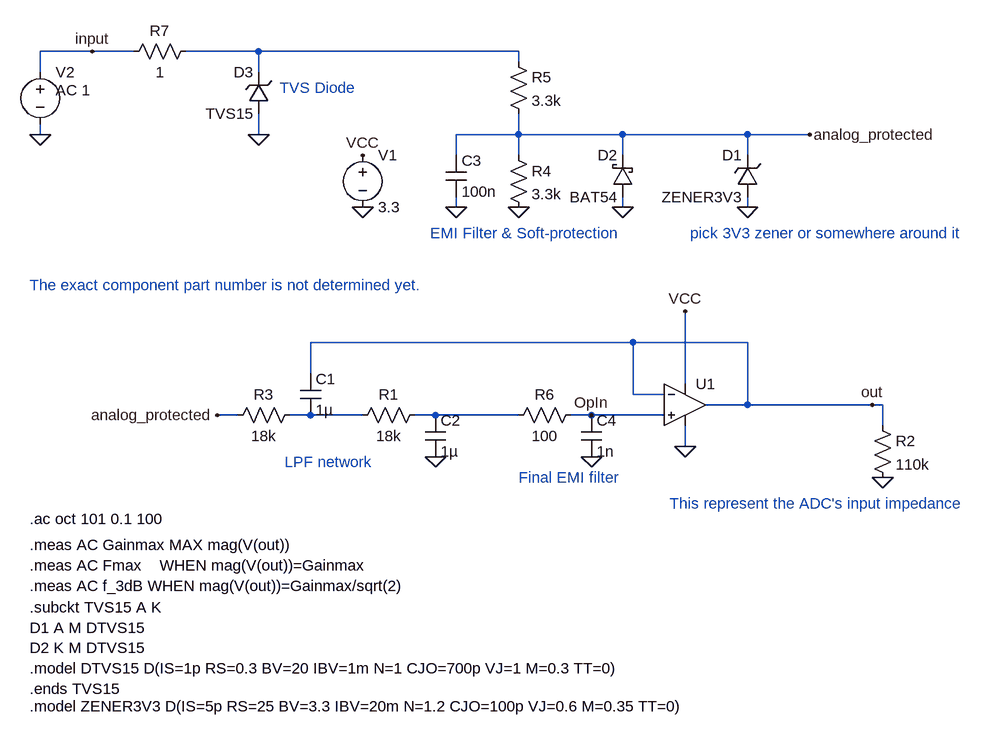
[diagram p0: schematic Anti-Alias Filter - BW.asc]
Anti-Alias Filter - BW.asc, the LTspice schematic file:
Version 4.1
SHEET 1 1140 912
WIRE -608 -240 -688 -240
WIRE -544 -240 -608 -240
WIRE -352 -240 -464 -240
WIRE 48 -240 -352 -240
WIRE 48 -224 48 -240
WIRE -688 -208 -688 -240
WIRE -352 -208 -352 -240
WIRE -688 -112 -688 -128
WIRE -352 -112 -352 -144
WIRE 48 -112 48 -144
WIRE 48 -112 -48 -112
WIRE 208 -112 48 -112
WIRE 400 -112 208 -112
WIRE 496 -112 400 -112
WIRE -48 -80 -48 -112
WIRE 48 -80 48 -112
WIRE 208 -80 208 -112
WIRE 400 -80 400 -112
WIRE -48 0 -48 -16
WIRE 208 0 208 -16
WIRE 400 0 400 -16
WIRE 224 208 -272 208
WIRE 400 208 224 208
WIRE -272 256 -272 208
WIRE 304 272 304 160
WIRE 224 288 224 208
WIRE 272 288 224 288
WIRE 400 304 400 208
WIRE 400 304 336 304
WIRE 592 304 400 304
WIRE 608 304 592 304
WIRE -384 320 -416 320
WIRE -272 320 -304 320
WIRE -192 320 -272 320
WIRE -80 320 -112 320
WIRE 48 320 -80 320
WIRE 160 320 128 320
WIRE 272 320 160 320
WIRE 608 336 608 304
WIRE 304 368 304 336
FLAG -80 384 0
FLAG 608 416 0
FLAG 304 368 0
FLAG -192 0 0
FLAG -688 -112 0
FLAG 48 0 0
FLAG 304 160 VCC
FLAG -192 -80 VCC
FLAG -48 0 0
FLAG 400 0 0
FLAG 160 384 0
FLAG -352 -112 0
FLAG 496 -112 analog_protected
FLAG -416 320 analog_protected
FLAG 208 0 0
FLAG 592 304 out
FLAG -608 -240 input
FLAG 160 320 OpIn
SYMBOL OpAmps\\UniversalOpAmp 304 304 R0
SYMATTR InstName U1
SYMBOL res -96 304 R90
WINDOW 0 0 56 VBottom 2
WINDOW 3 32 56 VTop 2
SYMATTR InstName R1
SYMATTR Value 18k
SYMBOL res -288 304 R90
WINDOW 0 0 56 VBottom 2
WINDOW 3 32 56 VTop 2
SYMATTR InstName R3
SYMATTR Value 18k
SYMBOL cap -288 256 R0
SYMATTR InstName C1
SYMATTR Value 1µ
SYMBOL cap -96 320 R0
SYMATTR InstName C2
SYMATTR Value 1µ
SYMBOL res 592 320 R0
SYMATTR InstName R2
SYMATTR Value 110k
SYMBOL voltage -192 -96 R0
WINDOW 123 0 0 Left 0
WINDOW 39 0 0 Left 0
SYMATTR InstName V1
SYMATTR Value 3.3
SYMBOL res 32 -96 R0
SYMATTR InstName R4
SYMATTR Value 3.3k
SYMBOL res 32 -240 R0
SYMATTR InstName R5
SYMATTR Value 3.3k
SYMBOL cap -64 -80 R0
SYMATTR InstName C3
SYMATTR Value 100n
SYMBOL cap 144 320 R0
SYMATTR InstName C4
SYMATTR Value 1n
SYMBOL res 144 304 R90
WINDOW 0 0 56 VBottom 2
WINDOW 3 32 56 VTop 2
SYMATTR InstName R6
SYMATTR Value 100
SYMBOL TVSdiode -336 -144 R180
WINDOW 0 24 64 Left 2
WINDOW 3 24 0 Left 2
SYMATTR InstName D3
SYMATTR Value TVS15
SYMATTR Description Diode
SYMATTR Type diode
SYMATTR Prefix X
SYMBOL zener 416 -16 R180
WINDOW 0 24 64 Left 2
WINDOW 3 24 0 Left 2
SYMATTR InstName D1
SYMATTR Value ZENER3V3
SYMATTR Description Diode
SYMATTR Type diode
SYMBOL schottky 224 -16 R180
WINDOW 0 24 64 Left 2
WINDOW 3 24 0 Left 2
SYMATTR InstName D2
SYMATTR Value BAT54
SYMATTR Description Diode
SYMATTR Type diode
SYMBOL res -448 -256 R90
WINDOW 0 0 56 VBottom 2
WINDOW 3 32 56 VTop 2
SYMATTR InstName R7
SYMATTR Value 1
SYMBOL voltage -688 -224 R0
WINDOW 123 24 44 Left 2
WINDOW 39 0 0 Left 0
SYMATTR Value2 AC 1
SYMATTR InstName V2
SYMATTR Value ""
TEXT -320 -184 Left 2 ;TVS Diode
TEXT -88 40 Left 2 ;EMI Filter & Soft-protection
TEXT -312 392 Left 2 ;LPF network
TEXT 48 416 Left 2 ;Final EMI filter
TEXT 312 40 Left 2 ;pick 3V3 zener or somewhere around it
TEXT -704 120 Left 2 ;The exact component part number is not determined yet.
TEXT 280 456 Left 2 ;This represent the ADC's input impedance
TEXT -704 616 Left 2 !.subckt TVS15 A K\nD1 A M DTVS15\nD2 K M DTVS15\n.model DTVS15 D(IS=1p RS=0.3 BV=20 IBV=1m N=1 CJO=700p VJ=1 M=0.3 TT=0)\n.ends TVS15
TEXT -704 768 Left 2 !.model ZENER3V3 D(IS=5p RS=25 BV=3.3 IBV=20m N=1.2 CJO=100p VJ=0.6 M=0.35 TT=0)
TEXT -704 480 Left 2 !.ac oct 101 0.1 100
TEXT -704 520 Left 2 !.meas AC Gainmax MAX mag(V(out))\n.meas AC Fmax    WHEN mag(V(out))=Gainmax\n.meas AC f_3dB WHEN mag(V(out))=Gainmax/sqrt(2)

The netlist it stands for:
* Anti-Alias Filter - BW.asc
X§U1 OpIn out VCC 0 out level1 Avol=1Meg GBW=10Meg Vos=0 En=0 Enk=0 In=0 Ink=0 Rin=500Meg  ; pins In+ In- V+ V- OUT
R1 N003 N002 18k
R3 N002 analog_protected 18k
C1 out N002 1µ
C2 N003 0 1µ
R2 out 0 110k
V1 VCC 0 3.3
R4 analog_protected 0 3.3k
R5 N001 analog_protected 3.3k
C3 analog_protected 0 100n
C4 OpIn 0 1n
R6 OpIn N003 100
X§D3 0 N001 TVS15  ; pins + -
D1 0 analog_protected ZENER3V3
D2 0 analog_protected BAT54
R7 N001 input 1
V2 input 0 AC 1
.model D D
.lib standard.dio
* TVS Diode
* EMI Filter & Soft-protection
* LPF network
* Final EMI filter
* pick 3V3 zener or somewhere around it
* The exact component part number is not determined yet.
* This represent the ADC's input impedance
.subckt TVS15 A K
D1 A M DTVS15
D2 K M DTVS15
.model DTVS15 D(IS=1p RS=0.3 BV=20 IBV=1m N=1 CJO=700p VJ=1 M=0.3 TT=0)
.ends TVS15
.model ZENER3V3 D(IS=5p RS=25 BV=3.3 IBV=20m N=1.2 CJO=100p VJ=0.6 M=0.35 TT=0)
.ac oct 101 0.1 100
.meas AC Gainmax MAX mag(V(out))
.meas AC Fmax    WHEN mag(V(out))=Gainmax
.meas AC f_3dB WHEN mag(V(out))=Gainmax/sqrt(2)
.lib UniversalOpAmp1.lib
.backanno
.end